# EAGLE design pic (EAGLE 8.3.2)
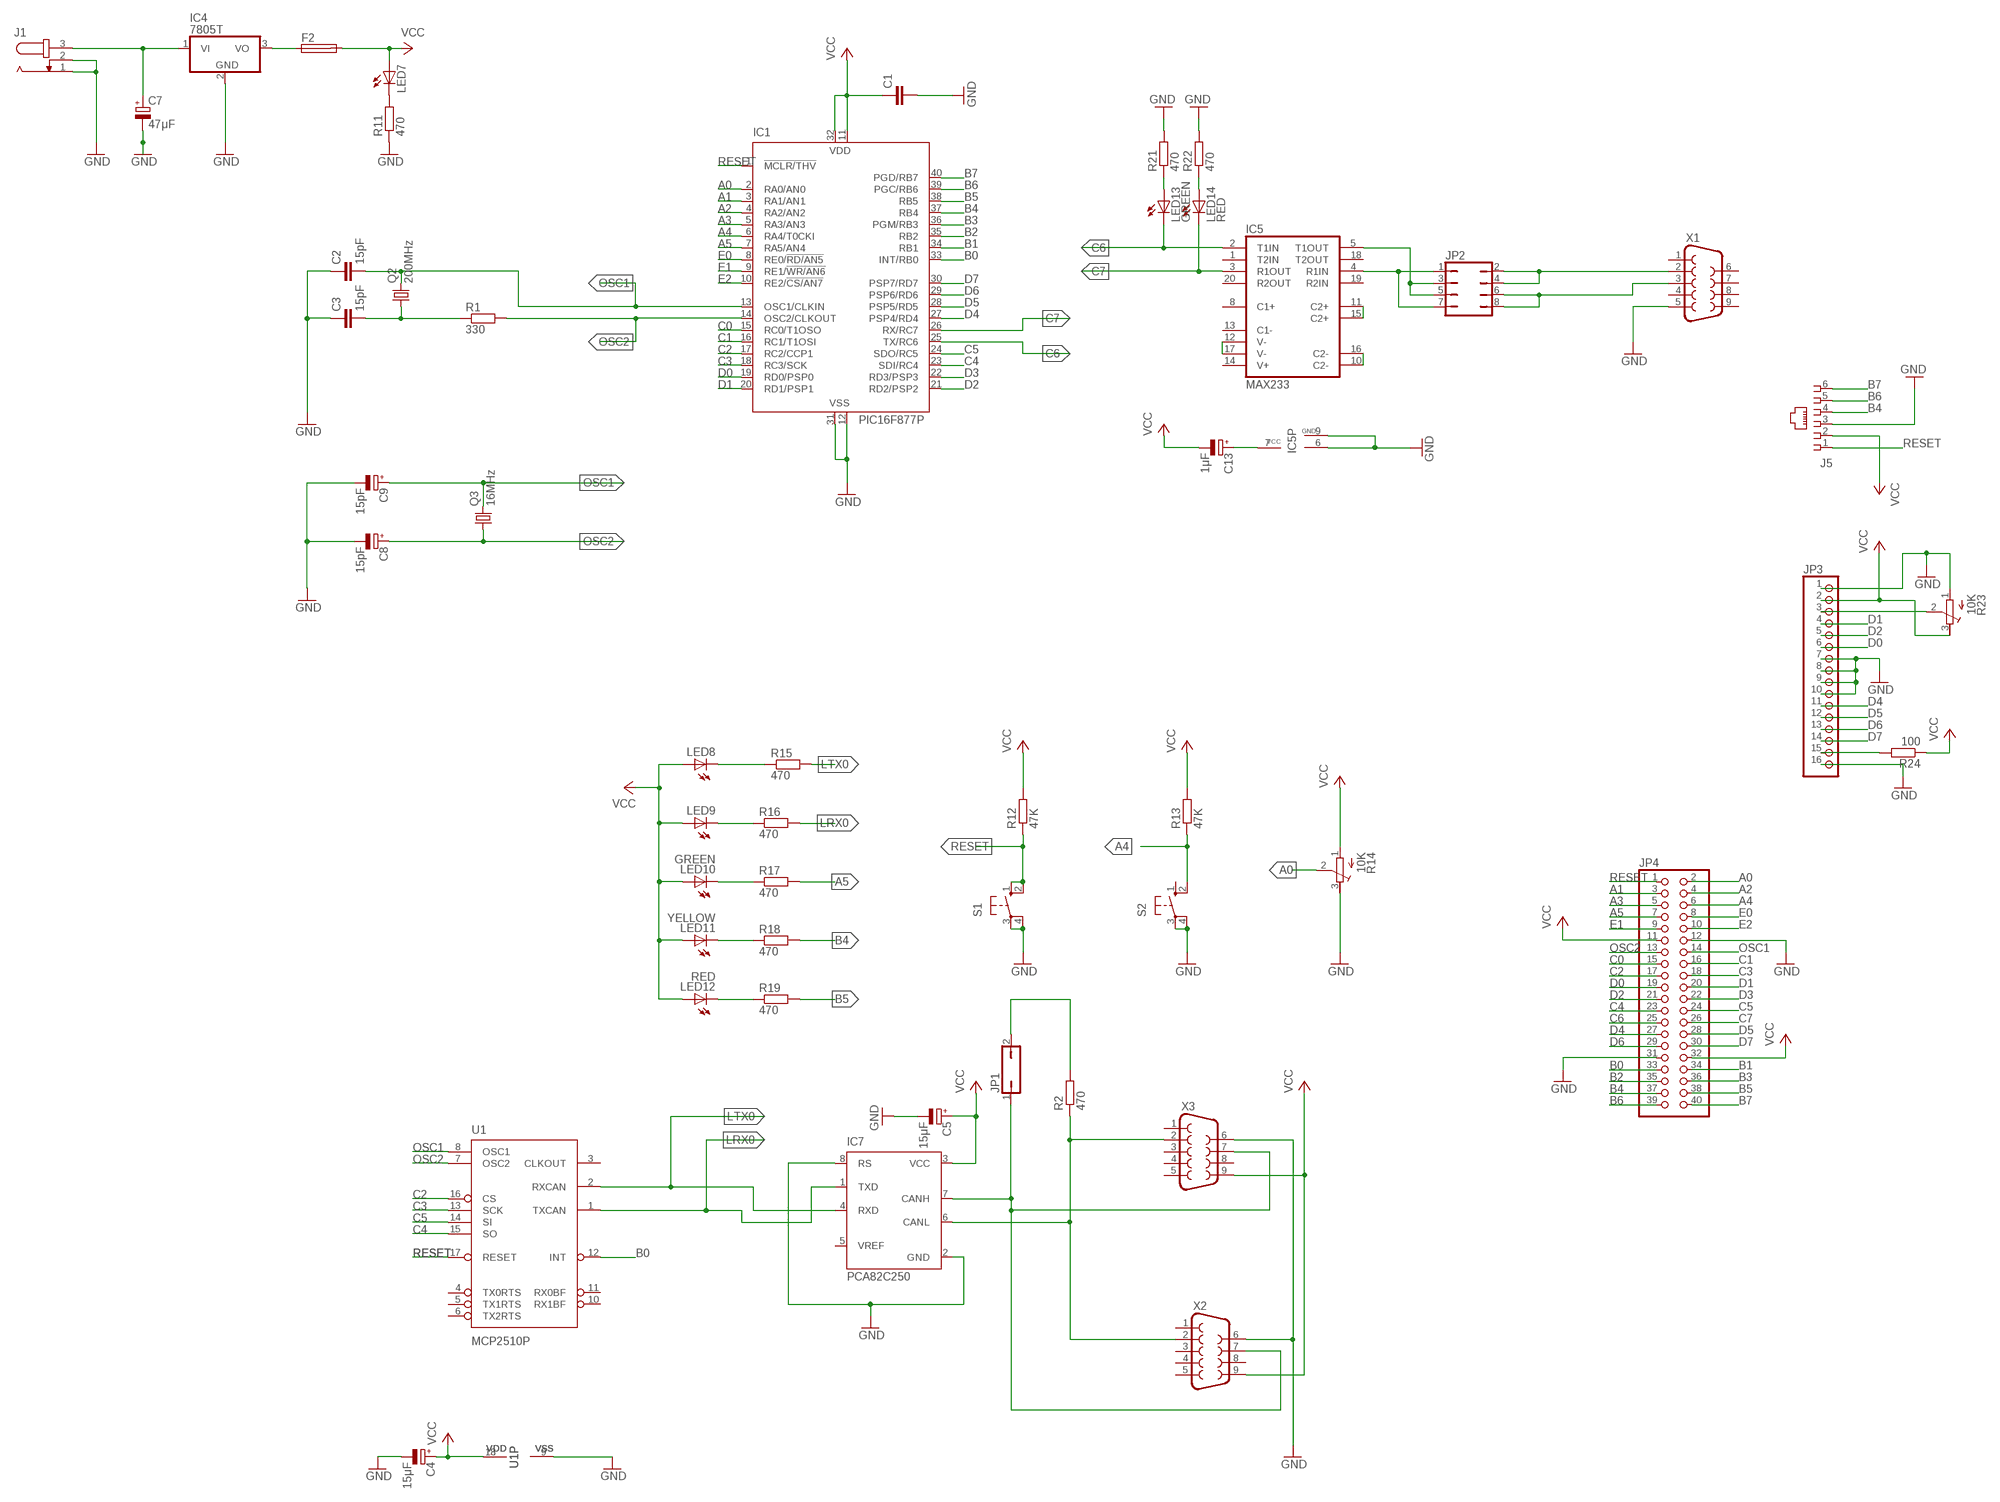
[diagram p0: schematic, sheet 1]

## Parts
C1  C5/5.5  [C5B5.5]
C2  15pF  C5/5.5  [C5B5.5]
C3  15pF  C5/5.5  [C5B5.5]
C4  15μF  CPOL-EUE2.5-5  [E2,5-5]
C5  15μF  CPOL-EUE2.5-5  [E2,5-5]
C7  47μF  CPOL-EUE2.5-5  [E2,5-5]
C8  15pF  CPOL-EUE2.5-5  [E2,5-5]
C9  15pF  CPOL-EUE2.5-5  [E2,5-5]
C13  1μF  CPOL-EUE2.5-5  [E2,5-5]
F2  F457  [F457]
IC1  PIC16F877P  [DIL40]
IC4  7805T  [TO220H]
IC5  MAX233  [DIL20]
IC7  PCA82C250  [DIL08]
J1  JACK-PLUG1  [SPC4078]
J5  520243-3  [520243-3]
JP1  JP1Q  [JP1]
JP2  JP4Q  [JP4Q]
JP3  PINHD-1X16  [1X16]
JP4  PINHD-2X20  [2X20]
LED7  LED5MM  [LED5MM]
LED8  LED5MM  [LED5MM]
LED9  LED5MM  [LED5MM]
LED10  GREEN  LED5MM  [LED5MM]
LED11  YELLOW  LED5MM  [LED5MM]
LED12  RED  LED5MM  [LED5MM]
LED13  GREEN  LED5MM  [LED5MM]
LED14  RED  LED5MM  [LED5MM]
Q2  200MHz  CRYSTALHC49U-H  [HC49U-H]
Q3  16MHz  CRYSTALHC49U-H  [HC49U-H]
R1  330  R-EU_0207/10  [0207/10]
R2  470  R0207/10  [0207/10]
R11  470  R-EU_0207/10  [0207/10]
R12  47K  R0207/10  [0207/10]
R13  47K  R0207/10  [0207/10]
R14  10K  R-TRIMM3296X  [RTRIM3296X]
R15  470  R0207/10  [0207/10]
R16  470  R0207/10  [0207/10]
R17  470  R0207/10  [0207/10]
R18  470  R0207/10  [0207/10]
R19  470  R0207/10  [0207/10]
R21  470  R-EU_0207/10  [0207/10]
R22  470  R-EU_0207/10  [0207/10]
R23  10K  R-TRIMM3296X  [RTRIM3296X]
R24  100  R0207/10  [0207/10]
S1  10-XX  [B3F-10XX]
S2  10-XX  [B3F-10XX]
U1  MCP2510P  [DIL18]
X1  F09HP  [F09HP]
X2  F09HP  [F09HP]
X3  F09HP  [F09HP]

## Nets
A0: IC1.2(RA0/AN0) JP4.2 R14.2(S)
A1: IC1.3(RA1/AN1) JP4.3
A2: IC1.4(RA2/AN2) JP4.4
A3: IC1.5(RA3/AN3) JP4.5
A4: IC1.6(RA4/T0CKI) JP4.6 R13.1 S2.2(S1)
A5: IC1.7(RA5/AN4) JP4.7 R17.2
B0: IC1.33(INT/RB0) JP4.33 U1.12(INT)
B1: IC1.34(RB1) JP4.34
B2: IC1.35(RB2) JP4.35
B3: IC1.36(PGM/RB3) JP4.36
B4: IC1.37(RB4) J5.4 JP4.37 R18.2
B5: IC1.38(RB5) JP4.38 R19.2
B6: IC1.39(PGC/RB6) J5.5 JP4.39
B7: IC1.40(PGD/RB7) J5.6 JP4.40
C0: IC1.15(RC0/T1OSO) JP4.15
C1: IC1.16(RC1/T1OSI) JP4.16
C2: IC1.17(RC2/CCP1) JP4.17 U1.16(CS)
C3: IC1.18(RC3/SCK) JP4.18 U1.13(SCK)
C4: IC1.23(SDI/RC4) JP4.23 U1.15(SO)
C5: IC1.24(SDO/RC5) JP4.24 U1.14(SI)
C6: IC1.25(TX/RC6) IC5.2(T1IN) JP4.25 LED13.K(C)
C7: IC1.26(RX/RC7) IC5.3(R1OUT) JP4.26 LED14.K(C)
D0: IC1.19(RD0/PSP0) JP3.6 JP4.19
D1: IC1.20(RD1/PSP1) JP3.4 JP4.20
D2: IC1.21(RD2/PSP2) JP3.5 JP4.21
D3: IC1.22(RD3/PSP3) JP4.22
D4: IC1.27(PSP4/RD4) JP3.11 JP4.27
D5: IC1.28(PSP5/RD5) JP3.12 JP4.28
D6: IC1.29(PSP6/RD6) JP3.13 JP4.29
D7: IC1.30(PSP7/RD7) JP3.14 JP4.30
E0: IC1.8(RE0/!RD/AN5) JP4.8
E1: IC1.9(RE1/!WR/AN6) JP4.9
E2: IC1.10(RE2/!CS/AN7) JP4.10
GND: C1.2 C2.1 C3.1 C4.- C5.- C7.- C8.- C9.- IC1.12(VSS) IC1.31(VSS) IC4.2(GND) IC5.6(GND) IC5.9(GND) IC7.2(GND) IC7.8(RS) J1.1 J1.2 J5.3 JP3.1 JP3.7 JP3.8 JP3.9 JP3.10 JP3.16 JP4.12 JP4.31 R11.1 R14.3(E) R21.2 R22.2 R23.1(A) S1.3(P) S1.4(P1) S2.3(P) S2.4(P1) U1.9(VSS) X1.5 X2.6 X3.6
LRX0: IC7.1(TXD) R16.2 U1.1(TXCAN)
LTX0: IC7.4(RXD) R15.2 U1.2(RXCAN)
N$1: JP1.2 R2.2
N$2: C3.2 Q2.1 R1.1
N$3: IC7.6(CANL) R2.1 X2.2 X3.2
N$4: IC7.7(CANH) JP1.1 X2.7 X3.7
N$10: C7.+ IC4.1(VI) J1.3
N$20: F2.1 IC4.3(VO)
N$21: LED7.K(C) R11.2
N$22: IC5.4(R1IN) JP2.1 JP2.7
N$23: IC5.5(T1OUT) JP2.3 JP2.5
N$24: JP2.2 JP2.4 X1.2
N$25: JP2.6 JP2.8 X1.3
N$26: IC5.12(V-) IC5.17(V-)
N$27: IC5.10(C2-) IC5.16(C2-)
N$28: IC5.11(C2+) IC5.15(C2+)
N$29: LED8.K(C) R15.1
N$30: LED9.K(C) R16.1
N$31: LED10.K(C) R17.1
N$32: LED11.K(C) R18.1
N$33: LED12.K(C) R19.1
N$35: LED13.A R21.1
N$36: LED14.A R22.1
N$38: JP3.3 R23.2(S)
N$45: JP3.15 R24.2
N$46: C13.+ IC5.7(VCC)
OSC1: C2.2 C9.+ IC1.13(OSC1/CLKIN) JP4.14 Q2.2 Q3.2 U1.8(OSC1)
OSC2: C8.+ IC1.14(OSC2/CLKOUT) JP4.13 Q3.1 R1.2 U1.7(OSC2)
RESET: IC1.1(!MCLR/THV) J5.1 JP4.1 R12.1 S1.1(S) S1.2(S1) U1.17(RESET)
VCC: C1.1 C4.+ C5.+ C13.- F2.2 IC1.11(VDD) IC1.32(VDD) IC7.3(VCC) J5.2 JP3.2 JP4.11 JP4.32 LED7.A LED8.A LED9.A LED10.A LED11.A LED12.A R12.2 R13.2 R14.1(A) R23.3(E) R24.1 U1.18(VDD) X2.9 X3.9
Unconnected: IC5.1(T2IN) IC5.8(C1+) IC5.13(C1-) IC5.14(V+) IC5.18(T2OUT) IC5.19(R2IN) IC5.20(R2OUT) IC7.5(VREF) S2.1(S) U1.3(CLKOUT) U1.4(TX0RTS) U1.5(TX1RTS) U1.6(TX2RTS) U1.10(RX1BF) U1.11(RX0BF) X1.1 X1.4 X1.6 X1.7 X1.8 X1.9 X2.1 X2.3 X2.4 X2.5 X2.8 X3.1 X3.3 X3.4 X3.5 X3.8

## Library data of the parts
C1-C3 = capacitor-wima:C: CAPACITOR naming: grid - package width
C4 C5 C7-C9 C13 = rcl:CPOL-EU: POLARIZED CAPACITOR, European symbol
F2 = fuse:F457: FUSE HOLDER CS, Schukat; OC_FARNELL: unknown; OC_NEWARK: unknown
IC1 = microchip:PIC16F87*: MICROCONTROLLER; MF: MICROCHIP; MPN: PIC16F877-04/P; OC_FARNELL: 9761349; OC_NEWARK: 61K3463
IC4 = adafruit:78*: Positive VOLTAGE REGULATOR Added bigger pads to the TO-92 package
IC5 = maxim:MAX233: RS232 TRANSCEIVER; MPN: MAX233ACPP+G36; OC_FARNELL: 1593332; OC_NEWARK: 89K3459
IC7 = micro-philips:PCA82C250: CAN CONTROLLER INTERFACE; OC_FARNELL: 3692358; OC_NEWARK: unknown
J1 = con-jack:JACK-PLUG: DC POWER JACK Power Jack, DC, Right Angle, Through Hole, Rated 5A at 16VDC, PC Terminals Distributor: Farnell (www.Farnell.de) Drawing: 84N1161.pdf / 84N1162.pdf Manufacturer: SPC Technology (www.spctechnology.com) Type: SPC4077 / SPC 4078; OC_FARNELL: unknown; OC_NEWARK: unknown
J5 = con-amp:520243-3: AMP connector
JP1 = jumper:JP1Q: JUMPER
JP2 = jumper:JP4Q: JUMPER
JP3 = pinhead:PINHD-1X16: PIN HEADER
JP4 = adafruit:PINHD-2X20: PIN HEADER
LED7-LED14 = adafruit:LED: LED OSRAM: - CHIPLED LG R971, LG N971, LY N971, LG Q971, LY Q971, LO R971, LY R971 LH N974, LH R974 LS Q976, LO Q976, LY Q976 LO Q996 - Hyper CHIPLED LW Q18S LB Q993, LB Q99A, LB R99A - SideLED LS A670, LO A670, LY A670, LG A670, LP A670 LB A673, LV A673, LT A673, LW A673 LH A674 LY A675 LS A676, LA A676, LO A676, LY A676, LW A676 LS A679, LY A679, LG A679 - Hyper Micro SIDELED® LS Y876, LA Y876, LO Y876, LY Y876 LT Y87S - SmartLED LW L88C, LW L88S LB L89C, LB L89S, LG L890 LS L89K, LO L89K, LY L89K LS L896, LA L896, LO L896, LY L896 - TOPLED LS T670, LO T670, LY T670, LG T670, LP T670 LSG T670, LSP T670, LSY T670, LOP T670, LYG T670 LG T671, LOG T671, LSG T671 LB T673, LV T673, LT T673, LW T673 LH T674 LS T676, LA T676, LO T676, LY T676, LB T676, LH T676, LSB T676, LW T676 LB T67C, LV T67C, LT T67C, LS T67K, LO T67K, LY T67K, LW E67C LS E67B, LA E67B, LO E67B, LY E67B, LB E67C, LV E67C, LT E67C LW T67C LS T679, LY T679, LG T679 LS T770, LO T770, LY T770, LG T770, LP T770 LB T773, LV T773, LT T773, LW T773 LH T774 LS E675, LA E675, LY E675, LS T675 LS T776, LA T776, LO T776, LY T776, LB T776 LHGB T686 LT T68C, LB T68C - Hyper Mini TOPLED® LB M676 - Mini TOPLED Santana® LG M470 LS M47K, LO M47K, LY M47K Source: http://www.osram.convergy.de/
Q2 Q3 = adafruit:CRYSTAL: CRYSTAL; OC_FARNELL: 1666973; OC_NEWARK: unknown
R1 R21 R22 = resistor:R-EU_: RESISTOR, European symbol
R2 R12 R13 R15-R19 R24 = eagle-ltspice:R: RESISTOR, European symbol; SPICEMODEL: NONE; SPICEPREFIX: R
R11 = rcl:R-EU_: RESISTOR, European symbol
R14 R23 = rcl:R-TRIMM: Trimm resistor
S1 S2 = switch-omron:10-XX: OMRON SWITCH; MPN: B3F-1000; OC_FARNELL: 176432; OC_NEWARK: 36M3542
U1 = microchip_can:MCP2510
X1-X3 = con-subd:F09: SUB-D; OC_FARNELL: unknown; OC_NEWARK: unknown

## Board
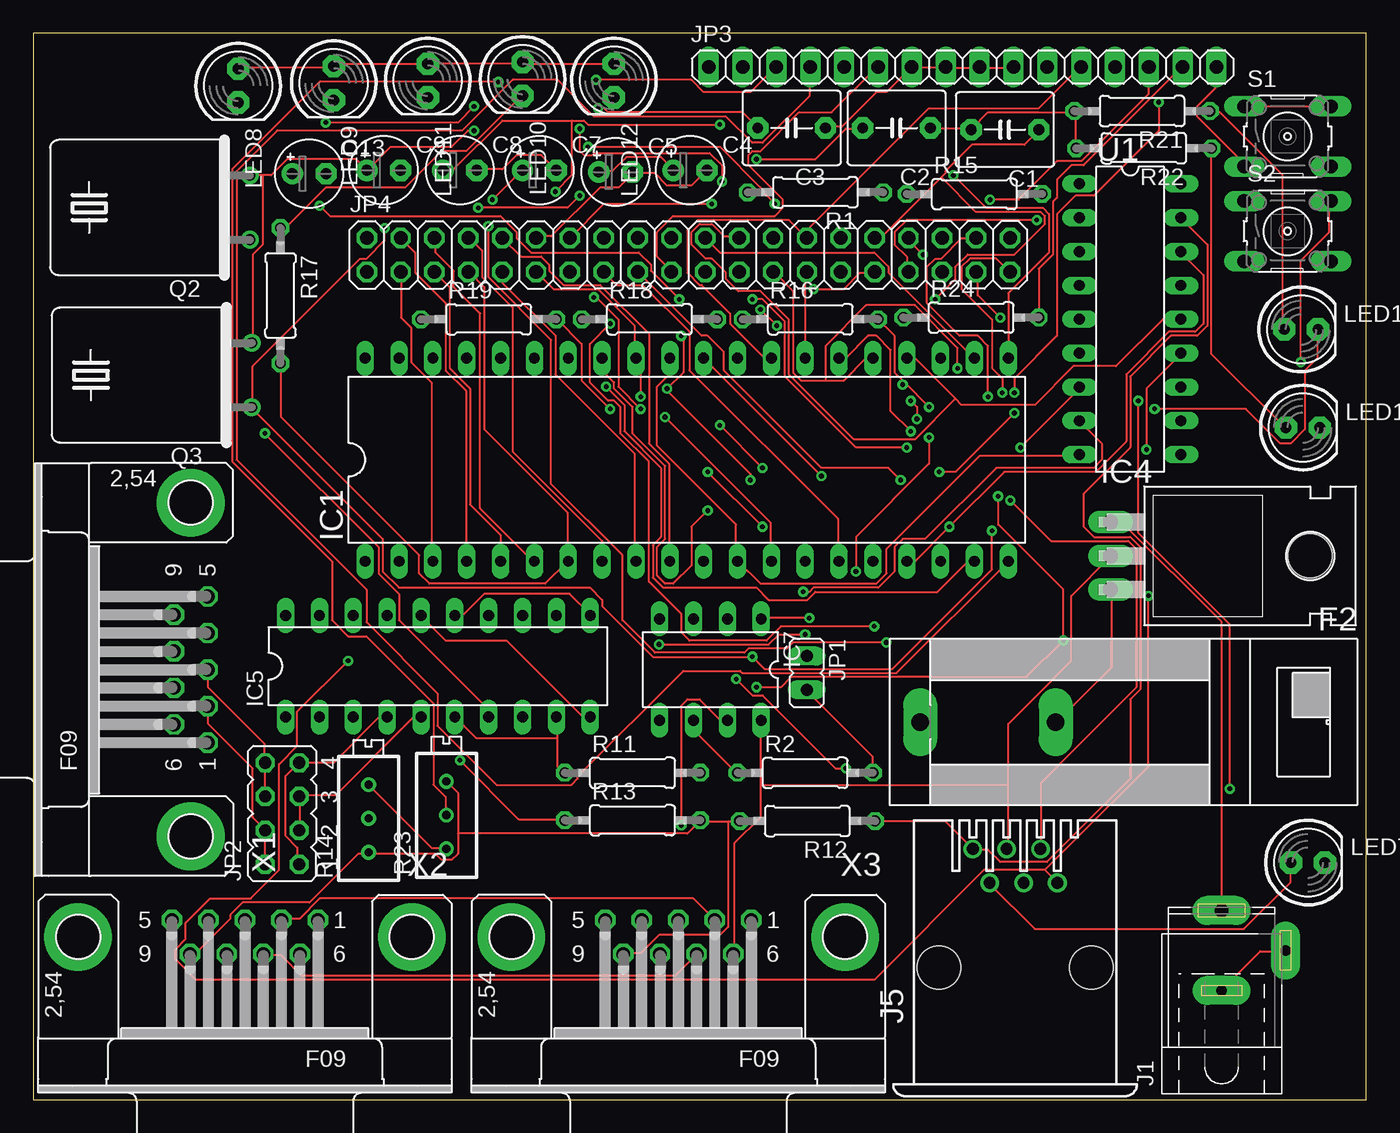
[diagram p1: board, top side]
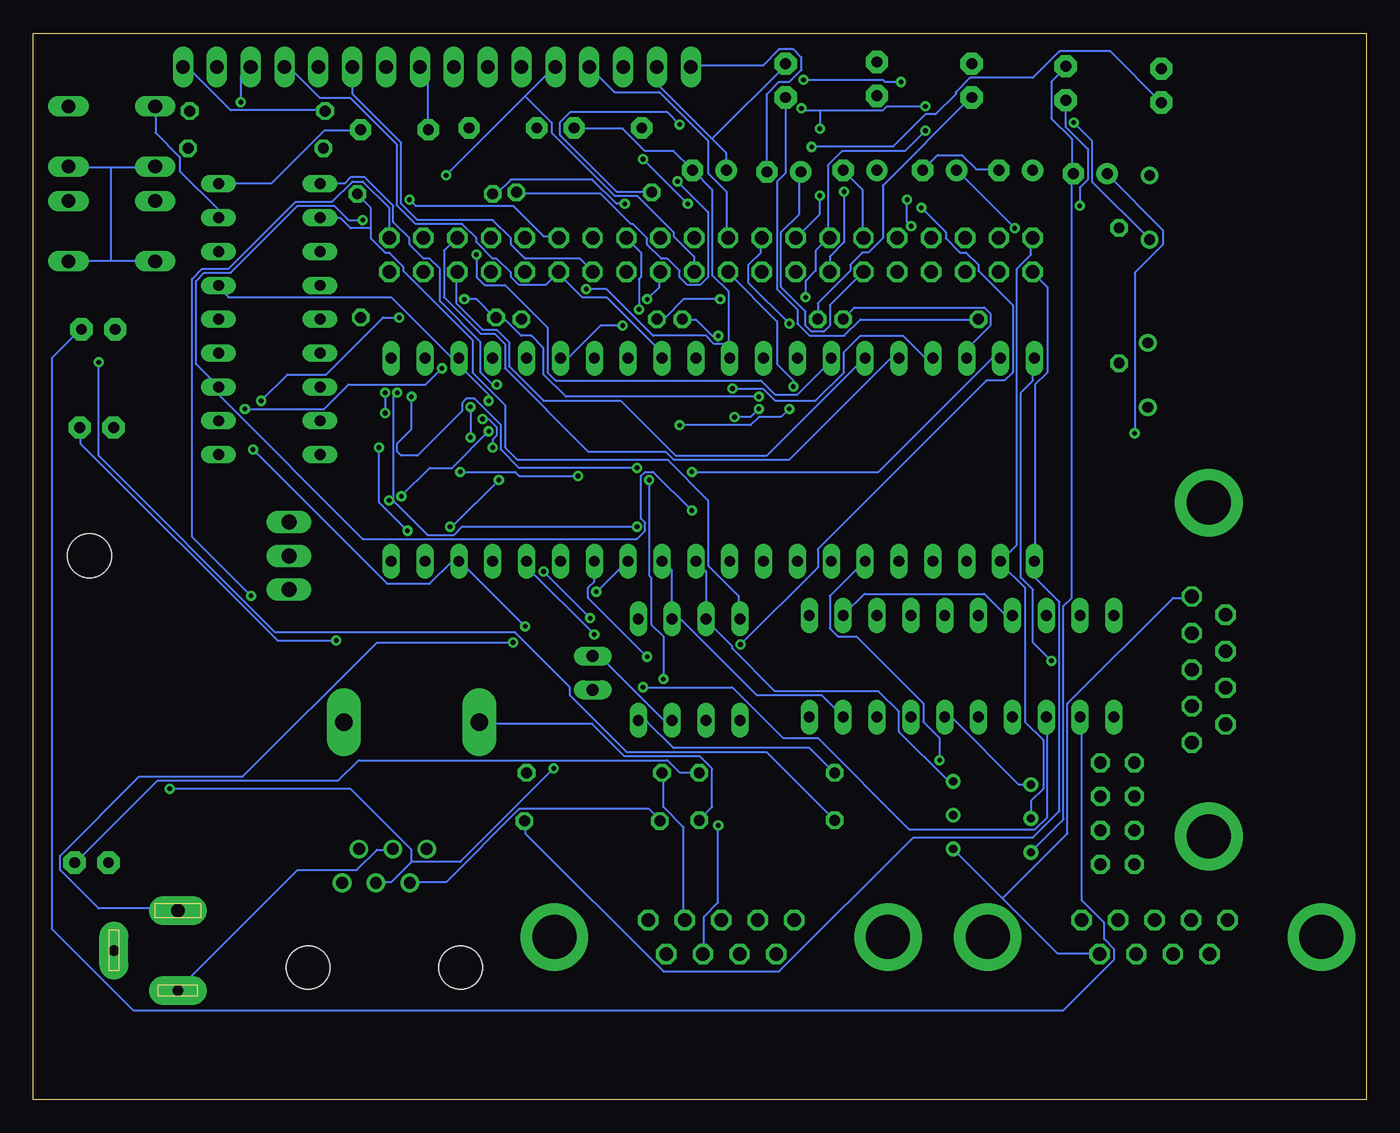
[diagram p2: board, bottom side, seen from below]

Size 100 x 80 mm. Coordinates in mm from the lower left corner, seen from the top.
Outline: 0,0 100,0 100,80 0,80 0,0
Copper layers (1*16): Top 0.035mm / dielectric 1.5mm / Bottom 0.035mm
Design rules "default": minimum track width 6mil, minimum drill 0.35mm, track to track 6mil, track to pad 6mil, pad to pad 6mil, via to via 6mil, smd to smd 6mil, copper to edge 40mil, drill to drill 6mil, minimum pad ring 10mil, minimum via ring 8mil, stop-mask expansion 4mil, vias tented up to drill 0mil, thermal gap 10mil

### Footprints (pad centres in the part's own frame; a part is rotated, then mirrored left to right if it is on the bottom)
C5B5.5 = drill 0.813 pad 1.6 octagon: 1 -2.54,0; 2 2.54,0
E2,5-5 = drill 0.813 pad 1.6: + -1.27,0 | drill 0.813 pad 1.6 octagon: - 1.27,0
F457 = drill 1.321 pad 2.54 long: 1 -5.08,0; 2 5.08,0
DIL40 = drill 0.813 long: 1 -24.13,-7.62; 2 -21.59,-7.62; 3 -19.05,-7.62; 4 -16.51,-7.62; 5 -13.97,-7.62; 6 -11.43,-7.62; 7 -8.89,-7.62; 8 -6.35,-7.62; 9 -3.81,-7.62; 10 -1.27,-7.62; 11 1.27,-7.62; 12 3.81,-7.62; 13 6.35,-7.62; 14 8.89,-7.62; 15 11.43,-7.62; 16 13.97,-7.62; 17 16.51,-7.62; 18 19.05,-7.62; 19 21.59,-7.62; 20 24.13,-7.62; 21 24.13,7.62; 22 21.59,7.62; 23 19.05,7.62; 24 16.51,7.62; 25 13.97,7.62; 26 11.43,7.62; 27 8.89,7.62; 28 6.35,7.62; 29 3.81,7.62; 30 1.27,7.62; 31 -1.27,7.62; 32 -3.81,7.62; 33 -6.35,7.62; 34 -8.89,7.62; 35 -11.43,7.62; 36 -13.97,7.62; 37 -16.51,7.62; 38 -19.05,7.62; 39 -21.59,7.62; 40 -24.13,7.62
TO220H = drill 1.118 long: 1 -2.54,-10.16; 2 0,-10.16; 3 2.54,-10.16 | hole 3.302: 0,4.826
DIL20 = drill 0.813 long: 1 -11.43,-3.81; 2 -8.89,-3.81; 3 -6.35,-3.81; 4 -3.81,-3.81; 5 -1.27,-3.81; 6 1.27,-3.81; 7 3.81,-3.81; 8 6.35,-3.81; 9 8.89,-3.81; 10 11.43,-3.81; 11 11.43,3.81; 12 8.89,3.81; 13 6.35,3.81; 14 3.81,3.81; 15 1.27,3.81; 16 -1.27,3.81; 17 -3.81,3.81; 18 -6.35,3.81; 19 -8.89,3.81; 20 -11.43,3.81
DIL08 = drill 0.813 long: 1 -3.81,-3.81; 2 -1.27,-3.81; 3 1.27,-3.81; 4 3.81,-3.81; 5 3.81,3.81; 6 1.27,3.81; 7 -1.27,3.81; 8 -3.81,3.81
SPC4078 = drill 0.8 pad 2.184 long: 1 -3,0; 2 0,-4.8 | drill 1 pad 2.184 long: 3 3,0
520243-3 = drill 0.889: 1 -3.175,8.89; 2 -1.905,6.35; 3 -0.635,8.89; 4 0.635,6.35; 5 1.905,8.89; 6 3.175,6.35 | hole 3.251: -5.715,0; 5.715,0
JP1 = drill 0.914 long: 1 0,-1.27; 2 0,1.27
JP4Q = drill 0.914 octagon: 1 -3.81,-1.27; 2 -3.81,1.27; 3 -1.27,-1.27; 4 -1.27,1.27; 5 1.27,-1.27; 6 1.27,1.27; 7 3.81,-1.27; 8 3.81,1.27
1X16 = drill 1.016 long: 1 -19.05,0; 2 -16.51,0; 3 -13.97,0; 4 -11.43,0; 5 -8.89,0; 6 -6.35,0; 7 -3.81,0; 8 -1.27,0; 9 1.27,0; 10 3.81,0; 11 6.35,0; 12 8.89,0; 13 11.43,0; 14 13.97,0; 15 16.51,0; 16 19.05,0
2X20 = drill 1.016 octagon: 1 -24.13,-1.27; 2 -24.13,1.27; 3 -21.59,-1.27; 4 -21.59,1.27; 5 -19.05,-1.27; 6 -19.05,1.27; 7 -16.51,-1.27; 8 -16.51,1.27; 9 -13.97,-1.27; 10 -13.97,1.27; 11 -11.43,-1.27; 12 -11.43,1.27; 13 -8.89,-1.27; 14 -8.89,1.27; 15 -6.35,-1.27; 16 -6.35,1.27; 17 -3.81,-1.27; 18 -3.81,1.27; 19 -1.27,-1.27; 20 -1.27,1.27; 21 1.27,-1.27; 22 1.27,1.27; 23 3.81,-1.27; 24 3.81,1.27; 25 6.35,-1.27; 26 6.35,1.27; 27 8.89,-1.27; 28 8.89,1.27; 29 11.43,-1.27; 30 11.43,1.27; 31 13.97,-1.27; 32 13.97,1.27; 33 16.51,-1.27; 34 16.51,1.27; 35 19.05,-1.27; 36 19.05,1.27; 37 21.59,-1.27; 38 21.59,1.27; 39 24.13,-1.27; 40 24.13,1.27
LED5MM = drill 0.813 pad 1.676 octagon: A -1.27,0; K 1.27,0
HC49U-H = drill 0.813: 1 -2.413,-5.08; 2 2.413,-5.08
0207/10 = drill 0.813 octagon: 1 -5.08,0; 2 5.08,0
RTRIM3296X = drill 0.61: 1 0,-2.54; 2 0,0; 3 0,2.54
B3F-10XX = drill 1.016 long: 1 -3.251,2.261; 2 3.251,2.261; 3 -3.251,-2.261; 4 3.251,-2.261
DIL18 = drill 0.813 long: 1 -10.16,-3.81; 2 -7.62,-3.81; 3 -5.08,-3.81; 4 -2.54,-3.81; 5 0,-3.81; 6 2.54,-3.81; 7 5.08,-3.81; 8 7.62,-3.81; 9 10.16,-3.81; 10 10.16,3.81; 11 7.62,3.81; 12 5.08,3.81; 13 2.54,3.81; 14 0,3.81; 15 -2.54,3.81; 16 -5.08,3.81; 17 -7.62,3.81; 18 -10.16,3.81
F09HP = drill 1.016 octagon: 1 -5.486,-1.27; 2 -2.743,-1.27; 3 0,-1.27; 4 2.743,-1.27; 5 5.486,-1.27; 6 -4.115,1.27; 7 -1.372,1.27; 8 1.372,1.27; 9 4.115,1.27 | drill 3.302 pad 5.08: G1 -12.522,0; G2 12.522,0

### Placement (x,y rotation side)
C1  72.9,72.77 180 top
C2  64.77,72.9 180 top
C3  56.9,72.9 180 top
C4  49.28,69.72 0 top
C5  43.69,69.6 0 top
C7  37.97,69.72 0 top
C8  32,69.72 0 top
C9  26.29,69.72 0 top
C13  20.7,69.47 0 top
F2  71.63,28.32 180 top
IC1  49.02,48.01 0 top
IC4  90.97,40.8 270 top
IC5  30.35,32.51 0 top
IC7  50.8,32.26 180 top
J1  89.15,11.18 90 top
J5  73.66,9.91 0 top
JP1  58.04,32 180 top
JP2  18.67,21.46 90 top
JP3  69.72,77.47 0 top
JP4  49.15,63.37 0 top
LED7  95.63,17.78 0 top
LED8  15.37,76.07 270 top
LED9  22.54,76.26 270 top
LED10  36.7,76.58 270 top
LED11  29.59,76.45 270 top
LED12  43.56,76.45 270 top
LED13  95.12,57.78 0 top
LED14  95.25,50.42 0 top
Q2  11.18,66.93 90 top
Q3  11.3,54.36 90 top
R1  58.67,68.07 180 top
R2  57.91,24.51 0 top
R11  44.96,24.51 0 top
R12  58.07,20.89 180 top
R13  44.96,20.95 0 top
R14  25.15,21.08 0 top
R15  70.61,67.94 0 top
R16  58.29,58.55 0 top
R17  18.54,60.33 270 top
R18  46.23,58.55 0 top
R19  34.16,58.55 0 top
R21  83.19,74.17 180 top
R22  83.31,71.37 180 top
R23  30.99,21.34 0 top
R24  70.36,58.67 0 top
S1  94.11,72.26 0 top
S2  94.11,65.15 0 top
U1  82.3,58.55 270 top
X1  11.81,32.26 90 top
X2  15.88,12.19 180 top
X3  48.39,12.19 180 top

### Tracks (layer width: path | path; a pad name or v marks a point on that pad's centre or on a via)
A0
  Bottom 0.152: R14.2 25.15,22.4 24.23,23.32 24.23,26.98 25.6,28.35 25.6,38.41 27.43,40.23 IC1.2 26.21,41.6 26.21,62.33 25.15,63.4 25.15,64.62 JP4.2
A1
  Top 0.152: IC1.3 29.87,40.39 29.87,53.8 28.35,55.32 28.35,57.91 27.58,58.67 27.58,62.03 JP4.3
A2
  Top 0.152: JP4.4 28.65,63.55 28.65,62.03 30.94,59.74 30.94,54.71 32.46,53.19 32.46,40.39 IC1.4
A3
  Top 0.152: IC1.5 35.05,42.37 32.77,44.65 32.77,53.34 31.24,54.86 31.24,60.96 JP4.5
A4  (via drill 0.35)
  Top 0.152: v32,25.45 36.42,21.03 39.78,21.03 R13.1 | JP4.6 30.18,64.62 30.18,63.55 31.55,62.18 31.55,60.96 33.53,58.98 33.53,44.35 37.49,40.39 IC1.6 | v95.1,55.32 95.1,62.94 97.23,65.08 97.23,67.36 S2.2
  Bottom 0.152: v32,25.45 32,27.13 33.22,28.35 33.22,29.72 38.25,34.75 39.62,34.75 40.23,35.36 40.23,37.8 37.64,40.39 IC1.6 | v95.1,55.32 95.1,48.31 81.84,35.05 63.86,35.05 59.74,30.94 59.74,30.33 55.47,26.06 44.96,26.06 39.93,21.03 R13.1
A5
  Top 0.152: 40.08,40.39 40.08,44.04 33.83,50.29 33.83,60.96 32.77,62.03 JP4.7 | 40.08,40.39 38.41,38.71 29.72,38.71 28.96,39.47 28.96,40.84 18.59,51.21 18.59,55.17 R17.2 | 40.08,40.39 IC1.7
B0  (via drill 0.35)
  Top 0.152: IC1.33 42.67,54.71 43.59,53.8 43.59,53.34 44.96,51.97 44.96,49.99 47.4,47.55 47.4,42.06 46.79,41.45 46.79,39.32 47.4,38.71 48.01,38.71 49.38,40.08 49.38,42.98 v50.6,44.2 | v75.29,65.99 65.53,65.99 64.62,65.08 64.62,64.16 65.53,63.25 65.53,62.18 JP4.33
  Bottom 0.152: v50.6,44.2 53.49,47.09 54.1,47.09 54.41,46.79 54.41,43.59 54.1,43.28 54.1,42.67 54.71,42.06 75.29,42.06 86.11,52.88 U1.12 86.11,53.49 87.78,55.17 87.78,61.42 87.17,62.03 85.19,62.03 80.16,67.06 77.42,67.06 76.35,65.99 v75.29,65.99
B1  (via drill 0.35)
  Top 0.152: v66.75,63.4 65.53,64.62 JP4.34
  Bottom 0.152: v66.75,63.4 66.75,61.72 66.14,61.11 64.62,61.11 61.42,57.91 61.42,54.56 60.81,53.95 45.41,53.95 44.35,52.88 42.67,52.88 40.23,55.32 40.23,55.63 IC1.34
B2
  Bottom 0.152: IC1.35 37.64,55.63 44.96,48.31 51.82,48.31 55.93,52.43 61.72,52.43 64.31,55.02 64.31,56.84 65.23,57.76 66.29,57.76 68.28,59.74 68.28,62.03 JP4.35
B3
  Bottom 0.152: IC1.36 35.66,55.63 43.28,48.01 51.97,48.01 52.58,48.62 58.37,48.62 64.62,54.86 64.62,56.69 65.38,57.45 66.45,57.45 69.19,60.2 69.19,63.7 68.28,64.62 JP4.36
B4  (via drill 0.35)
  Top 0.152: v48.62,57.3 48.77,57.15 48.77,54.56 v47.55,53.34 47.55,53.19 53.8,46.94 v53.8,46.48 | v60.96,24.84 60.2,24.84 54.71,30.33 53.95,30.33 v52.73,31.55 | v72.54,58.67 70.87,60.35 70.87,62.03 JP4.37 | v82.91,52.43 82.91,42.52 89.76,35.66 v89.76,23.32
  Bottom 0.152: IC1.37 33.07,55.63 34.75,57.3 37.95,57.3 39.17,56.08 39.17,54.56 41.3,52.43 44.35,52.43 45.26,53.34 v47.55,53.34 | v48.62,57.3 49.07,57.3 50.29,58.52 51.21,58.52 R18.2 | 71.63,17.83 73.15,16.31 74.22,16.31 J5.4 | 71.63,17.83 67.97,17.83 v60.96,24.84 | v52.73,31.55 52.73,34.75 53.65,35.66 53.65,39.17 53.8,39.32 v53.8,46.48 | v72.54,58.67 73.76,58.67 78.03,54.41 80.92,54.41 v82.91,52.43 | v89.76,23.32 76.2,23.32 71.63,18.75 71.63,17.83
B5  (via drill 0.35)
  Top 0.152: v71.63,52.73 71.63,56.54 70.87,57.3 69.49,57.3 67.06,59.74 67.06,62.48 67.67,63.09 68.12,63.09 69.65,64.62 70.71,64.62 JP4.38 | v51.51,50.6 v54.71,47.4 | v43.28,51.82 41.15,53.95 41.15,56.69 39.32,58.52 R19.2
  Bottom 0.152: IC1.38 29.87,55.63 29.87,56.39 28.19,58.06 28.19,58.98 28.65,59.44 38.41,59.44 39.17,58.67 R19.2 | v71.63,52.73 71.63,50.29 72.69,49.23 72.69,48.62 72.39,48.31 71.17,48.31 67.82,51.66 67.82,52.27 67.51,52.58 66.9,52.58 64.92,50.6 64.92,48.77 63.55,47.4 v54.71,47.4 | v51.51,50.6 46.18,50.6 45.57,51.21 43.89,51.21 v43.28,51.82
B6  (via drill 0.35)
  Top 0.152: v54.71,42.98 v50.6,47.09 | v72.69,53.03 72.69,54.1 71.93,54.86 71.93,58.52 69.65,60.81 69.65,62.48 70.26,63.09 72.24,63.09 73.15,62.18 JP4.39 | v73.3,44.96 76.35,41.91 82.14,41.91 82.75,41.3 82.75,30.94 75.59,23.77 75.59,18.9 J5.5
  Bottom 0.152: IC1.39 28.04,55.63 36.58,47.09 v50.6,47.09 | v54.71,42.98 67.82,42.98 68.43,42.37 70.41,42.37 73,44.96 | 73,44.96 73,52.73 v72.69,53.03 | 73,44.96 v73.3,44.96
B7  (via drill 0.35)
  Top 0.152: v23.62,32.92 19.81,29.11 19.81,26.52 18.44,25.15 18.44,17.22 16.31,15.09 13.26,15.09 11.43,13.26 11.43,12.04 10.67,11.28 10.67,10.52 12.19,8.99 63.09,8.99 71.32,17.22 75.89,17.22 | 75.89,17.22 76.81,16.31 J5.6 | v83.67,37.8 83.67,24.99 75.89,17.22
  Bottom 0.152: v23.62,32.92 24.99,34.29 24.99,38.25 25.91,39.17 25.91,53.03 24.99,53.95 24.99,55.63 IC1.40 | v83.67,37.8 88.09,42.22 88.09,61.57 87.33,62.33 85.34,62.33 80.31,67.36 77.57,67.36 76.05,68.89 75.29,68.89 73.3,66.9 73.3,64.77 JP4.40
C0
  Top 0.152: IC1.15 60.35,40.39 60.35,43.59 49.23,54.71 49.23,57.61 45.72,61.11 43.74,61.11 42.82,62.03 JP4.15
C1  (via drill 0.35)
  Top 0.152: v57.91,34.9 55.93,34.9 55.17,34.14 v46.94,34.14 | v33.38,66.9 40.08,66.9 v41,67.82
  Bottom 0.152: v57.91,34.9 62.94,39.93 62.94,40.39 IC1.16 | v46.94,34.14 41.15,39.93 41.15,41.3 28.5,53.95 27.13,53.95 26.52,54.56 26.52,59.59 29.11,62.18 29.11,62.64 30.02,63.55 30.48,63.55 31.55,64.62 31.55,65.08 v33.38,66.9 | v41,67.82 41,66.45 JP4.16
C2  (via drill 0.35)
  Top 0.152: IC1.17 66.14,40.39 v68.73,42.98 72.85,47.09 79.7,47.09 81.99,49.38 81.99,54.41 85.19,57.61 87.17,57.61 87.78,58.22 87.78,61.87 86.11,63.55 U1.16 | JP4.17 50.14,57.3 50.6,57.3 51.82,56.08 51.82,54.71 59.13,47.4 64.16,47.4 v65.08,46.48
  Bottom 0.152: v65.08,46.48 68.58,42.98 v68.73,42.98
C3  (via drill 0.35)
  Top 0.152: v83.52,48.77 83.52,53.34 86.11,55.93 U1.13 | v43.28,58.22 41.76,56.69 41.76,53.8 43.13,52.43 43.59,52.43 44.04,51.97 44.04,49.99 46.18,47.85 46.18,38.86 48.62,36.42 48.62,35.05 49.23,34.44 55.02,34.44 56.08,35.51 v63.09,35.51
  Bottom 0.152: v83.52,48.77 73.46,38.71 70.26,38.71 68.58,40.39 IC1.18 67.97,40.39 v63.09,35.51 | v43.28,58.22 46.33,61.27 46.33,62.64 45.41,63.55 45.41,64.62 JP4.18
C4  (via drill 0.35)
  Top 0.152: v53.95,60.05 54.71,60.05 56.39,58.37 56.39,54.25 61.72,48.92 v65.53,48.92 | v66.29,51.05 66.29,51.97 v65.84,52.43
  Bottom 0.152: U1.15 86.11,60.96 85.34,60.2 73.15,60.2 68.58,55.63 IC1.23 67.97,55.63 67.97,55.02 65.84,52.88 v65.84,52.43 | v53.95,60.05 53.03,60.96 53.03,62.03 JP4.23 | v65.53,48.92 65.53,49.53 65.23,49.84 65.23,50.44 65.84,51.05 v66.29,51.05
C5
  Top 0.152: IC1.24 66.14,55.63 69.19,52.58 | 69.19,52.58 69.65,52.12 75.13,52.12 78.03,55.02 81.23,55.02 84.73,58.52 86.11,58.52 U1.14 | 69.19,52.58 66.14,49.53 61.57,49.53 56.69,54.41 56.69,58.52 54.56,60.66 52.88,60.66 51.97,61.57 51.97,62.03 50.9,63.09 50.44,63.09 49.38,64.16 49.38,65.08 49.99,65.68 50.9,65.68 51.82,64.77 52.88,64.77 JP4.24
C6  (via drill 0.35)
  Top 0.152: IC1.25 62.48,55.63 60.81,53.95 59.44,53.95 | 59.44,53.95 57.61,53.95 57,54.56 57,60.66 55.63,62.03 JP4.25 | 59.44,53.95 59.44,56.54 62.48,59.59 66.14,59.59 69.34,56.39 v69.34,54.86 | v84.12,51.82 90.98,51.82 93.57,49.23 94.34,49.23 95.4,50.29 95.4,54.71 96.32,55.63 96.32,57.76 LED13.K
  Bottom 0.152: IC5.2 21.34,28.65 21.34,14.94 19.66,13.26 19.66,12.04 18.9,11.28 18.9,10.52 22.71,6.71 92.51,6.71 98.6,12.8 98.6,55.63 96.47,57.76 LED13.K | v69.34,54.86 70.56,53.65 76.35,53.65 78.18,51.82 v84.12,51.82
C7  (via drill 0.35)
  Top 0.152: v54.56,59.28 v55.78,58.06 | v54.25,30.94 56.08,30.94 56.84,31.7 74.52,31.7 v77.27,34.44 77.27,38.25 72.39,43.13 v72.39,45.26 | IC1.26 60.96,55.63 62.64,57.3 63.25,57.3 64.31,56.24 64.31,51.66 v65.84,50.14
  Bottom 0.152: IC1.26 59.89,55.63 57.45,58.06 v55.78,58.06 | v54.56,59.28 54.56,61.57 54.41,61.72 54.41,63.55 JP4.26 | v54.25,30.94 47.55,30.94 43.74,27.13 41.15,27.13 34.29,20.27 24.84,20.27 23.93,21.18 23.93,28.65 IC5.3 | v77.27,34.44 81.69,34.44 96.47,49.23 96.47,50.29 LED14.K | v65.84,50.14 68.58,47.4 70.26,47.4 v72.39,45.26
D0  (via drill 0.35)
  Top 0.152: IC1.19 70.1,40.39 67.82,38.1 58.67,38.1 58.06,37.49 55.17,37.49 54.25,38.41 47.24,38.41 46.48,39.17 46.48,41.6 47.09,42.22 47.09,47.4 44.35,50.14 44.35,52.12 v42.98,53.49 | JP3.6 63.25,77.42 59.89,74.07 57.45,74.07 54.56,71.17 53.95,71.17 53.65,70.87 53.65,70.1 56.24,67.51 56.24,66.9 55.63,66.29 48.01,66.29 46.79,65.08 46.79,63.25 47.85,62.18 JP4.19
  Bottom 0.152: v42.98,53.49 42.98,53.95 44.2,55.17 44.2,58.37 47.85,62.03 JP4.19
D1
  Top 0.152: IC1.20 64.77,32 53.19,32 53.03,32.16 48.77,32.16 40.84,24.23 40.84,24.08 40.39,23.62 34.75,23.62 30.33,28.04 30.33,30.48 24.99,35.81 24.99,38.25 15.24,48.01 15.24,69.65 18.29,72.69 32.16,72.69 35.97,76.5 39.32,76.5 42.06,73.76 51.97,73.76 53.95,71.78 54.71,71.78 58.22,75.29 58.22,77.42 JP3.4
  Bottom 0.152: JP4.20 48.01,64.77 48.01,68.12 49.38,69.49 49.38,71.93 53.03,75.59 56.39,75.59 58.22,77.42 JP3.4
D2  (via drill 0.35)
  Top 0.152: IC1.21 73.15,60.5 76.2,63.55 76.2,66.45 75.74,66.9 71.48,66.9 v69.04,69.34
  Bottom 0.152: 63.09,75.29 60.96,77.42 JP3.5 | 63.09,75.29 v69.04,69.34 | 63.09,75.29 61.11,73.3 61.11,72.54 56.39,67.82 54.71,67.82 51.97,65.08 51.97,64.77 50.44,63.25 50.44,62.18 JP4.21
D3
  Top 0.152: JP4.22 51.51,63.55 63.09,63.55 64.16,62.48 64.16,62.03 70.56,55.63 IC1.22
D4
  Top 0.152: IC1.27 57.91,62.03 JP4.27
  Bottom 0.152: JP3.11 76.05,77.42 76.05,75.44 72.39,71.78 72.39,67.21 71.17,65.99 65.53,65.99 64.16,64.62 64.16,64.16 63.09,63.09 58.98,63.09 58.06,62.18 JP4.27
D5
  Top 0.152: IC1.28 54.86,55.63 52.27,58.22 52.27,58.98 50.14,61.11 49.99,61.11 49.07,62.03 49.07,65.23 49.84,65.99 56.69,65.99 57.76,64.92 | 57.76,64.92 JP4.28 57.91,64.77 | 57.76,64.92 67.21,74.37 75.44,74.37 78.49,77.42 JP3.12
D6
  Bottom 0.152: 60.66,62.03 58.83,60.2 57,60.2 52.88,56.08 52.88,55.63 IC1.29 | 60.66,62.03 61.57,61.11 63.55,61.11 64.16,61.72 64.16,62.03 65.23,63.09 65.53,63.09 66.75,64.31 66.75,64.62 67.82,65.68 71.32,65.68 72.69,67.06 72.69,71.63 76.2,75.13 78.49,75.13 80.77,77.42 81.08,77.42 JP3.13 | 60.66,62.03 JP4.29
D7  (via drill 0.35)
  Top 0.152: v59.13,46.79 IC1.30 | v67.97,47.09 69.19,47.09 v73.61,51.51 | v73.61,53.03 73.61,54.1 76.81,57.3 76.81,66.45 78.18,67.82 79.55,67.82 84.43,72.69 v84.43,74.83 | v71.78,67.51 73.91,67.51 76.81,70.41 78.64,70.41 83.67,75.44 83.67,77.42 JP3.14
  Bottom 0.152: v59.13,46.79 63.55,46.79 63.86,47.09 v67.97,47.09 | v73.61,53.03 v73.61,51.51 | v84.43,74.83 84.43,76.81 83.82,77.42 JP3.14 | v71.78,67.51 71.32,67.06 64.01,67.06 61.72,64.77 60.66,64.77 JP4.30
E0
  Top 0.152: IC1.8 42.67,41.91 35.97,48.62 35.97,59.44 33.68,61.72 33.68,63.7 32.77,64.62 JP4.8
E1
  Top 0.152: IC1.9 45.11,40.39 45.11,48.46 39.17,54.41 39.17,57.3 35.2,61.27 35.2,62.03 JP4.9
E2
  Top 0.152: JP4.10 36.58,63.25 38.1,63.25 38.71,62.64 38.71,62.18 39.78,61.11 42.52,61.11 46.18,57.45 46.18,49.23 47.7,47.7 47.7,40.39 IC1.10
GND  (via drill 0.35)
  Top 0.152: JP3.16 88.7,77.42 88.7,75.89 87.33,74.52 87.33,73.76 90.98,70.1 S1.3 | R22.2 78.18,71.48 78.18,74.07 R21.2 78.03,74.07 71.63,74.07 70.41,72.85 C1.2 70.26,72.85 67.36,72.85 C2.1 | JP3.10 73.46,77.42 71.02,77.42 JP3.9 70.87,77.42 68.58,77.42 JP3.8 68.43,77.42 65.99,77.42 JP3.7 65.84,77.42 64.01,75.59 63.25,75.59 60.66,73 59.44,73 C3.1 | C7.- 38.1,70.87 36.27,70.87 35.2,69.8 33.38,69.8 C8.- | v58.52,60.81 60.81,60.81 62.03,62.03 63.09,62.03 JP4.31 | 44.96,69.49 46.63,69.49 47.55,68.58 49.38,68.58 50.44,69.65 C4.- | 44.96,69.49 43.89,68.43 42.52,68.43 38.86,64.77 37.8,64.77 JP4.12 | 44.96,69.49 C5.- | 73.15,23.62 73.15,18.9 J5.3 | 73.15,23.62 73.15,28.19 77.88,32.92 77.88,37.8 80.77,40.69 IC4.2 | J1.2 93.88,11.12 92.05,11.12 89.15,8.23 J1.1 | U1.9 78.49,48.31 71.02,48.31 64.01,41.3 64.01,39.47 63.25,38.71 54.56,38.71 52.88,40.39 IC1.12 52.73,40.39 52.73,43.13 46.79,49.07 46.79,53.49 47.7,54.41 47.7,55.63 IC1.31 | 39.32,27.13 39.32,24.99 39.78,24.54 R11.1 | 39.32,27.13 39.32,28.65 IC5.9 | 54.56,23.62 54.56,28.35 IC7.8 | 54.56,23.62 54.56,21.18 52.58,19.2 52.58,10.97 X3.6 | R14.3 29.87,18.9 30.94,18.9 R23.1 | 39.32,27.13 33.22,27.13 31.7,28.65 IC5.6 | 54.56,23.62 73.15,23.62
  Bottom 0.152: 94.18,62.94 97.23,62.94 S2.4 | 94.18,62.94 90.98,62.94 S2.3 | 94.18,69.95 97.23,69.95 S1.4 | 94.18,69.95 90.98,69.95 S1.3 | 94.18,69.95 94.18,62.94 | C1.2 70.41,72.85 70.41,76.96 70.87,77.42 JP3.9 | JP3.16 88.7,77.42 88.39,77.42 85.19,74.22 78.18,74.22 R21.2 | C9.- 27.58,69.8 29.26,69.8 30.33,70.87 32.16,70.87 33.22,69.8 C8.- | C7.- 37.8,68.28 37.8,64.77 JP4.12 | C5.- 44.96,75.44 44.04,76.35 43.28,76.35 42.37,77.27 42.37,78.18 42.98,78.79 44.04,78.79 45.26,77.57 50.6,77.57 JP3.1 | 47.85,56.69 47.85,60.66 49.07,61.87 49.07,68.28 50.44,69.65 C4.- 50.6,69.8 51.97,71.17 54.1,71.17 55.78,72.85 59.44,72.85 C3.1 | 47.85,56.69 47.85,55.63 IC1.31 47.85,56.69 | v58.52,60.81 57,60.81 53.49,57.3 49.53,57.3 48.92,56.69 47.85,56.69 | J5.3 73.15,18.75 74.22,18.75 75.74,17.22 80.16,17.22 89.15,8.23 J1.1 | IC1.12 52.73,40.39 52.12,39.78 52.12,36.12 IC7.2 51.97,35.97 51.36,35.97 45.72,30.33 40.84,30.33 39.32,28.8 IC5.9 | IC7.8 54.56,28.35 53.95,28.35 51.97,26.36 41.76,26.36 39.93,24.54 R11.1 | R14.3 26.06,23.62 31.09,28.65 31.55,28.65 IC5.6 | R23.1 27.28,15.09 | 27.28,15.09 23.16,10.97 20.12,10.97 X2.6 | 27.28,15.09 22.4,19.96 22.4,29.72 14.48,37.64 13.11,37.64 X1.5
LRX0  (via drill 0.35)
  Top 0.152: v58.22,36.12 54.71,36.12 IC7.1 | v61.72,39.62 61.72,42.22 67.21,47.7 v67.21,49.68 | 65.38,53.8 64.62,54.56 64.62,57.3 R16.2 | 65.38,53.8 v67.21,51.97 | 65.38,53.8 v65.23,53.65
  Bottom 0.152: v61.72,39.62 v58.22,36.12 | v67.21,51.97 v67.21,49.68 | v65.23,53.65 65.53,53.65 66.45,54.56 66.45,56.84 69.49,59.89 69.49,62.33 70.26,63.09 70.71,63.09 71.78,64.16 71.78,64.62 73,65.84 73,67.06 75.13,69.19 76.2,69.19 76.66,68.73 78.49,68.73 U1.1
LTX0
  Bottom 0.152: 74.68,65.38 74.68,66.9 75.59,67.82 R15.2 | 74.68,65.38 74.68,64.62 73.61,63.55 73.3,63.55 72.24,62.48 72.24,62.18 67.06,57 67.06,54.56 64.62,52.12 64.62,48.92 63.7,48.01 52.43,48.01 49.38,44.96 49.38,40.08 47.09,37.8 47.09,36.12 IC7.4 | 74.68,65.38 76.2,65.38 76.96,66.14 78.49,66.14 U1.2
N$1
  Top 0.152: R2.2 62.94,24.54 62.94,25.76 58.06,30.63 JP1.2
N$2  (via drill 0.35)
  Top 0.152: v21.95,73.3 31.85,73.3 v33.07,74.52 | v42.37,74.37 42.82,74.37 43.13,74.07 53.19,74.07 C3.2 | v51.66,68.89 51.66,70.1 50.75,71.02 42.06,71.02 41.91,70.87 41.3,70.87 41,71.17 v41,72.85
  Bottom 0.152: v21.95,73.3 20.57,71.93 20.57,68.89 16.31,64.62 Q2.1 | v33.07,74.52 35.97,74.52 36.27,74.22 41,74.22 | 41,74.22 42.22,74.22 v42.37,74.37 | v51.66,68.89 49.38,66.6 49.38,61.72 49.99,61.11 50.9,61.11 51.51,61.72 51.51,62.18 52.43,63.09 52.88,63.09 53.95,64.16 53.95,64.62 55.02,65.68 55.17,65.68 57.45,67.97 63.7,67.97 R1.1 | 41,74.22 v41,72.85
N$3
  Top 0.152: IC7.6 49.53,27.74 52.73,24.54 R2.1 | X2.2 18.75,13.56 19.96,13.56 21.49,15.09 49.53,15.09 51.05,13.56 X3.2
  Bottom 0.152: R2.1 52.73,24.38 52.73,21.95 51.21,20.42 51.21,13.56 X3.2
N$4  (via drill 0.35)
  Top 0.152: X2.7 17.37,10.82 18.59,10.82 20.12,9.3 48.16,9.3 49.68,10.82 X3.7 | v48.62,20.57 48.62,29.57 49.07,30.02 49.99,30.02 51.51,28.5 51.97,28.5 IC7.7
  Bottom 0.152: IC7.7 52.12,28.5 52.73,28.5 57.45,33.22 57.91,33.22 JP1.1 | v48.62,20.57 48.62,14.78 49.68,13.72 49.68,10.97 X3.7
N$10  (via drill 0.35)
  Top 0.152: v34.44,67.51 36.58,69.65 C7.+ | v34.14,65.53 34.14,61.72 38.86,57 38.86,46.18 44.2,40.84 44.2,35.97 46.63,33.53 53.34,33.53 53.65,33.83 56.54,33.83 57,34.29 v64.01,34.29 | J1.3 89.15,35.81 81.69,43.28 80.92,43.28 IC4.1
  Bottom 0.152: v34.44,67.51 34.44,65.84 v34.14,65.53 | v64.01,34.29 74.22,34.29 84.28,24.23 92.05,24.23 97.99,18.29 97.99,17.22 95.1,14.33 89.15,14.33 J1.3
N$20
  Top 0.152: IC4.3 80.92,38.25 80.92,32.46 76.81,28.35 F2.1
N$21
  Bottom 0.152: R11.2 50.14,24.54 51.51,24.54 52.43,25.45 75.59,25.45 77.11,23.93 90.68,23.93 96.77,17.83 LED7.K
N$22
  Top 0.152: IC5.4 26.52,28.65 25.91,28.65 22.55,25.3 19.96,25.3 JP2.7 18.9,24.23 18.9,19.81 19.81,18.9 19.81,17.68 JP2.1
N$23
  Top 0.152: IC5.5 28.96,28.65 28.5,28.65 22.71,22.86 19.96,22.86 JP2.5 19.96,22.71 19.96,20.27 JP2.3
N$24
  Top 0.152: JP2.2 17.37,17.68 17.37,20.12 JP2.4 17.37,20.27 16.46,21.18 16.46,24.84 13.11,28.19 13.11,29.41 X1.2
N$25
  Top 0.152: JP2.6 17.37,22.86 17.37,25.15 JP2.8 17.37,25.3 17.37,26.67 13.11,30.94 13.11,32.16 X1.3
N$26
  Bottom 0.152: IC5.17 26.67,36.42 27.13,36.42 28.65,37.95 37.64,37.95 39.17,36.42 IC5.12
N$27
  Top 0.152: IC5.10 41.76,28.8 41.15,28.8 35.51,34.44 30.94,34.44 29.11,36.27 IC5.16
N$28
  Top 0.152: IC5.15 31.7,36.42 32.31,36.42 33.83,37.95 40.23,37.95 41.76,36.42 IC5.11
N$29  (via drill 0.35)
  Top 0.152: v55.63,67.21 54.56,68.28 54.56,68.43 51.51,71.48 v41.6,71.48
  Bottom 0.152: v55.63,67.21 56.24,67.21 58.06,69.04 64.16,69.04 65.23,67.97 65.53,67.97 R15.1 | v41.6,71.48 35.51,71.48 33.07,73.91 32.31,73.91 30.79,75.44 30.79,75.59 29.72,76.66 24.99,76.66 23.01,78.64 19.2,78.64 LED8.K
N$30  (via drill 0.35)
  Top 0.152: v48.46,60.05 46.33,62.18 46.33,62.64 45.41,63.55 37.34,63.55 36.27,64.62 36.27,65.08 35.05,66.29 22.25,66.29 v21.49,67.06
  Bottom 0.152: v48.46,60.05 51.21,60.05 52.58,58.67 53.19,58.67 R16.1 | v21.49,67.06 21.49,68.43 20.88,69.04 20.88,71.32 22.55,73 22.55,74.98 LED9.K
N$31
  Top 0.152: R17.1 18.59,65.53 19.05,65.53 21.95,68.43 27.89,68.43 30.63,71.17 32.46,71.17 36.58,75.29 LED10.K
N$32
  Bottom 0.152: R18.1 41.15,59.74 38.71,62.18 38.71,62.64 37.8,63.55 37.34,63.55 36.27,64.62 36.27,68.58 29.72,75.13 LED11.K
N$33
  Bottom 0.152: R19.1 29.11,58.52 37.95,58.52 39.17,57.3 41.76,57.3 42.67,58.22 42.67,59.28 44.2,60.81 44.2,68.89 43.59,69.49 43.59,75.13 LED12.K
N$35
  Top 0.152: R21.1 88.39,74.07 89,74.07 93.73,69.34 93.73,57.91 LED13.A
N$36
  Top 0.152: R22.1 88.39,55.93 93.88,50.44 LED14.A
N$38  (via drill 0.35)
  Top 0.152: v34.9,76.35 21.49,76.35 14.94,69.8 14.94,47.85 22.4,40.39 22.4,35.97 23.62,34.75 24.99,34.75 30.02,29.72 30.02,23.62 30.94,22.71 30.94,21.34 R23.2 | v42.22,76.5 49.38,76.5 50.29,75.59 53.8,75.59 55.63,77.42 JP3.3
  Bottom 0.152: v34.9,76.35 36.12,76.35 36.27,76.5 v42.22,76.5
N$45
  Top 0.152: R24.2 75.44,62.33 76.5,63.4 76.5,67.36 76.81,67.67 76.81,69.04 77.88,70.1 78.79,70.1 86.11,77.42 JP3.15
N$46  (via drill 0.35)
  Top 0.152: v17.37,49.99 25.91,41.45 25.91,39.47 27.43,37.95 27.43,35.97 34.14,29.26 34.14,28.8 IC5.7
  Bottom 0.152: v17.37,49.99 17.37,62.03 15.24,64.16 15.24,65.23 19.36,69.34 C13.+
OSC1  (via drill 0.35)
  Top 0.152: v57.76,38.1 58.22,38.1 58.52,38.41 63.4,38.41 64.62,39.62 64.62,41.45 65.23,42.06 66.9,42.06 72.24,47.4 79.55,47.4 80.16,48.01 80.16,49.23 78.49,50.9 U1.8 | 17.22,69.34 17.83,69.34 19.05,70.56 24.23,70.56 24.99,69.8 C9.+ 25.15,69.8 26.82,71.48 31.39,71.48 32.61,72.69 v33.07,72.69 | 17.22,69.34 Q2.2 | 17.22,69.34 17.22,64.16 16.46,63.4 16.46,56.84 Q3.2 | v54.25,70.56 58.67,70.56 60.96,72.85 62.18,72.85 C2.2 | v50.9,67.21 42.82,67.21 JP4.14 | v47.4,51.21 55.32,43.28 55.32,40.39 IC1.13 | v45.57,51.82 43.89,53.49 43.89,58.52 42.22,60.2 v42.06,60.2
  Bottom 0.152: v57.76,38.1 55.47,40.39 IC1.13 | v33.07,72.69 34.59,71.17 39.32,71.17 40.39,70.1 40.39,64.77 JP4.14 40.39,64.62 41.3,63.7 41.3,62.18 42.06,61.42 v42.06,60.2 | v50.9,67.21 v54.25,70.56 | v47.4,51.21 46.18,51.21 v45.57,51.82
OSC2  (via drill 0.35)
  Top 0.152: v51.51,73.15 41.6,73.15 41.3,73.46 40.39,73.46 | 40.39,73.46 35.2,73.46 31.55,69.8 30.79,69.8 C8.+ | v39.17,68.12 40.39,69.34 40.39,73.46 | v74.07,48.92 78.49,53.34 U1.7 | v71.93,42.67 71.93,39.78 64.47,32.31 54.86,32.31 v53.95,33.22 46.48,33.22 42.67,37.03 42.67,37.49 41.76,38.41 27.43,38.41 26.21,39.62 26.21,42.06 16.46,51.82 Q3.1 16.46,51.97 16.46,55.02 24.54,63.09 24.99,63.09 26.36,64.47 v26.36,65.38
  Bottom 0.152: v51.51,73.15 52.43,74.07 59.74,74.07 60.5,73.3 60.5,72.39 56.24,68.12 53.65,68.12 R1.2 | v39.17,68.12 39.17,64.31 40.23,63.25 40.23,62.18 JP4.13 | IC1.14 57.91,38.86 58.37,38.41 58.37,37.64 v53.95,33.22 | v74.07,48.92 74.07,44.81 v71.93,42.67 | v26.36,65.38 30.63,69.65 C8.+
RESET
  Top 0.152: R12.1 63.25,20.88 68.43,20.88 70.41,18.9 J5.1 70.56,18.75 71.63,18.75 72.54,17.83 76.05,17.83 82.3,24.08 82.3,30.02 83.06,30.79 83.06,41.45 82.3,42.22 79.55,42.22 78.79,42.98 78.79,45.41 82.3,48.92 82.3,54.25 85.34,57.3 87.33,57.3 88.09,58.06 88.09,64.16 86.11,66.14 U1.17 | S1.1 S1.2
  Bottom 0.152: 24.84,40.39 24.84,53.65 23.93,54.56 23.93,60.96 24.99,62.03 JP4.1 | U1.17 86.11,66.75 89,69.65 89,70.71 90.83,72.54 90.83,74.52 S1.1 | 24.84,40.39 24.84,39.17 23.01,37.34 23.01,21.64 24.99,19.66 33.98,19.66 44.04,9.6 52.73,9.6 63.09,19.96 63.09,20.88 R12.1 | 24.84,40.39 IC1.1
VCC  (via drill 0.35)
  Top 0.152: C5.+ 42.52,69.65 43.43,69.65 44.5,70.71 47.09,70.71 48.01,69.8 C4.+ | LED12.A 36.73,77.72 LED10.A 36.58,77.72 LED11.A 22.71,77.72 22.55,77.57 LED9.A 22.4,77.42 15.39,77.42 LED8.A | 68.12,69.19 68.43,69.49 68.43,69.65 70.41,71.63 74.37,71.63 75.44,72.69 C1.1 | 68.12,69.19 63.7,64.77 63.25,64.77 JP4.32 | JP4.11 39.01,60.81 42.37,60.81 45.11,58.06 45.11,55.63 IC1.32 45.26,55.63 45.57,55.32 v45.57,52.73 | 68.12,69.19 70.71,66.6 75.59,66.6 75.89,66.29 75.89,65.68 73.61,63.4 70.1,63.4 69.19,62.48 69.19,61.57 v67.67,60.05 | 25.15,18.44 30.18,18.44 30.63,17.98 31.39,17.98 31.85,18.44 31.85,19.96 | 31.85,19.96 31.85,23.01 R23.3 | 25.15,18.44 24.38,18.44 20.73,14.78 15.7,14.78 14.78,13.87 14.78,13.56 12.19,10.97 11.89,10.97 X2.9 | 25.15,18.44 R14.1 | 52.12,20.88 50.14,20.88 R13.2 49.99,20.88 49.07,19.96 31.85,19.96 | 52.12,20.88 52.88,20.88 R12.2 | 52.12,20.88 52.12,12.95 51.51,12.34 46.94,12.34 45.57,10.97 44.35,10.97 X3.9 | LED7.A 94.34,17.68 94.34,16.31 90.83,12.8 75.13,12.8 71.78,16.15 J5.2
  Bottom 0.152: 49.07,72.08 48.01,71.02 C4.+ | 49.07,72.08 53.19,76.2 53.19,77.42 JP3.2 | LED9.A 22.55,77.42 23.62,76.35 23.62,73.61 22.1,72.08 22.1,69.49 C13.- 22.1,69.34 22.1,37.64 22.71,37.03 22.71,21.03 25.15,18.59 R14.1 | 49.07,72.08 43.43,77.72 LED12.A | U1.18 86.11,68.73 82.14,68.73 78.18,72.69 75.44,72.69 C1.1 | v45.57,52.73 60.05,52.73 61.72,54.41 61.72,56.39 62.64,57.3 63.4,57.3 64.77,58.67 R24.1 65.38,58.67 66.75,60.05 v67.67,60.05 | JP4.11 40.23,59.59 40.23,58.06 40.69,57.61 41.6,57.61 42.06,58.06 42.06,59.13 43.89,60.96 43.89,65.08 42.52,66.45 42.52,69.49 C5.+ | IC1.11 49.53,39.62 IC7.3 49.53,35.97 47.55,33.98 47.55,33.83 44.35,30.63 36.58,30.63 35.05,29.11 35.05,27.58 31.39,23.93 31.09,23.93 R23.3 | J5.2 71.63,16.31 69.04,16.31 63.55,21.79 53.8,21.79 53.03,21.03 R12.2 | F2.2 66.45,28.19 58.06,28.19 55.63,25.76 49.99,25.76 49.07,24.84 49.07,21.95 49.99,21.03 R13.2